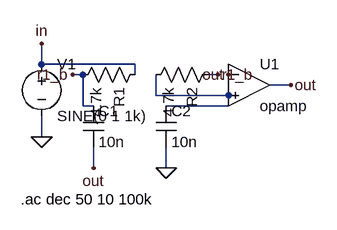
[diagram p0: schematic sk.asc]
sk.asc, the LTspice schematic file:
Version 4
SHEET 1 880 680
WIRE 128 80 272 80
WIRE 272 80 272 96
WIRE 128 80 128 48
WIRE 128 160 128 192
WIRE 192 96 176 96
WIRE 384 96 400 96
WIRE 304 96 304 128
WIRE 304 128 416 128
WIRE 208 144 192 144
WIRE 192 144 192 96
WIRE 208 208 208 240
WIRE 320 144 416 144
WIRE 416 144 416 128
WIRE 320 208 320 240
WIRE 480 112 512 112
FLAG 128 48 in
FLAG 128 192 0
FLAG 176 96 r1_b
FLAG 400 96 r1_b
FLAG 208 240 out
FLAG 320 240 0
FLAG 512 112 out
FLAG 416 96 out
SYMBOL voltage 128 64 R0
SYMATTR InstName V1
SYMATTR Value SINE(0 1 1k)
SYMATTR Value2 AC 1
SYMBOL res 288 80 R90
SYMATTR InstName R1
SYMATTR Value 4.7k
SYMBOL res 400 80 R90
SYMATTR InstName R2
SYMATTR Value 4.7k
SYMBOL OpAmps/opamp 448 48 R0
SYMATTR InstName U1
SYMBOL cap 192 144 R0
SYMATTR InstName C1
SYMATTR Value 10n
SYMBOL cap 304 144 R0
SYMATTR InstName C2
SYMATTR Value 10n
TEXT 96 288 Left 2 !.ac dec 50 10 100k

The netlist it stands for:
* sk.asc
V1 in 0 SINE(0 1 1k) AC 1
R1 in r1_b 4.7k
R2 r1_b N001 4.7k
XU1 out N001 out opamp Aol=100K GBW=10Meg  ; pins invin noninvin out
C1 r1_b out 10n
C2 N001 0 10n
.ac dec 50 10 100k
.backanno
.end